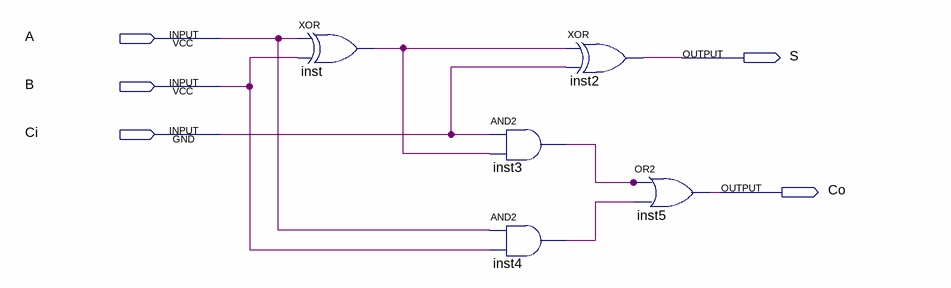
[diagram p0: schematic sheet]
// Quartus schematic fulladder.bdf as structural Verilog: 5 symbols, 5 pins
module fulladder (
  input  A,
  input  B,
  input  Ci,
  output S,
  output Co
);

  wire inst3_out, inst4_out, inst_out;

  xor inst (inst_out, A, B);
  and inst3 (inst3_out, Ci, inst_out);
  and inst4 (inst4_out, A, B);
  xor inst2 (S, inst_out, Ci);
  or inst5 (Co, inst3_out, inst4_out);
endmodule
